# Altium schematic sheet Servo_PCB.SchDoc
size Letter; SheetNumber: 1; SheetTotal: 1
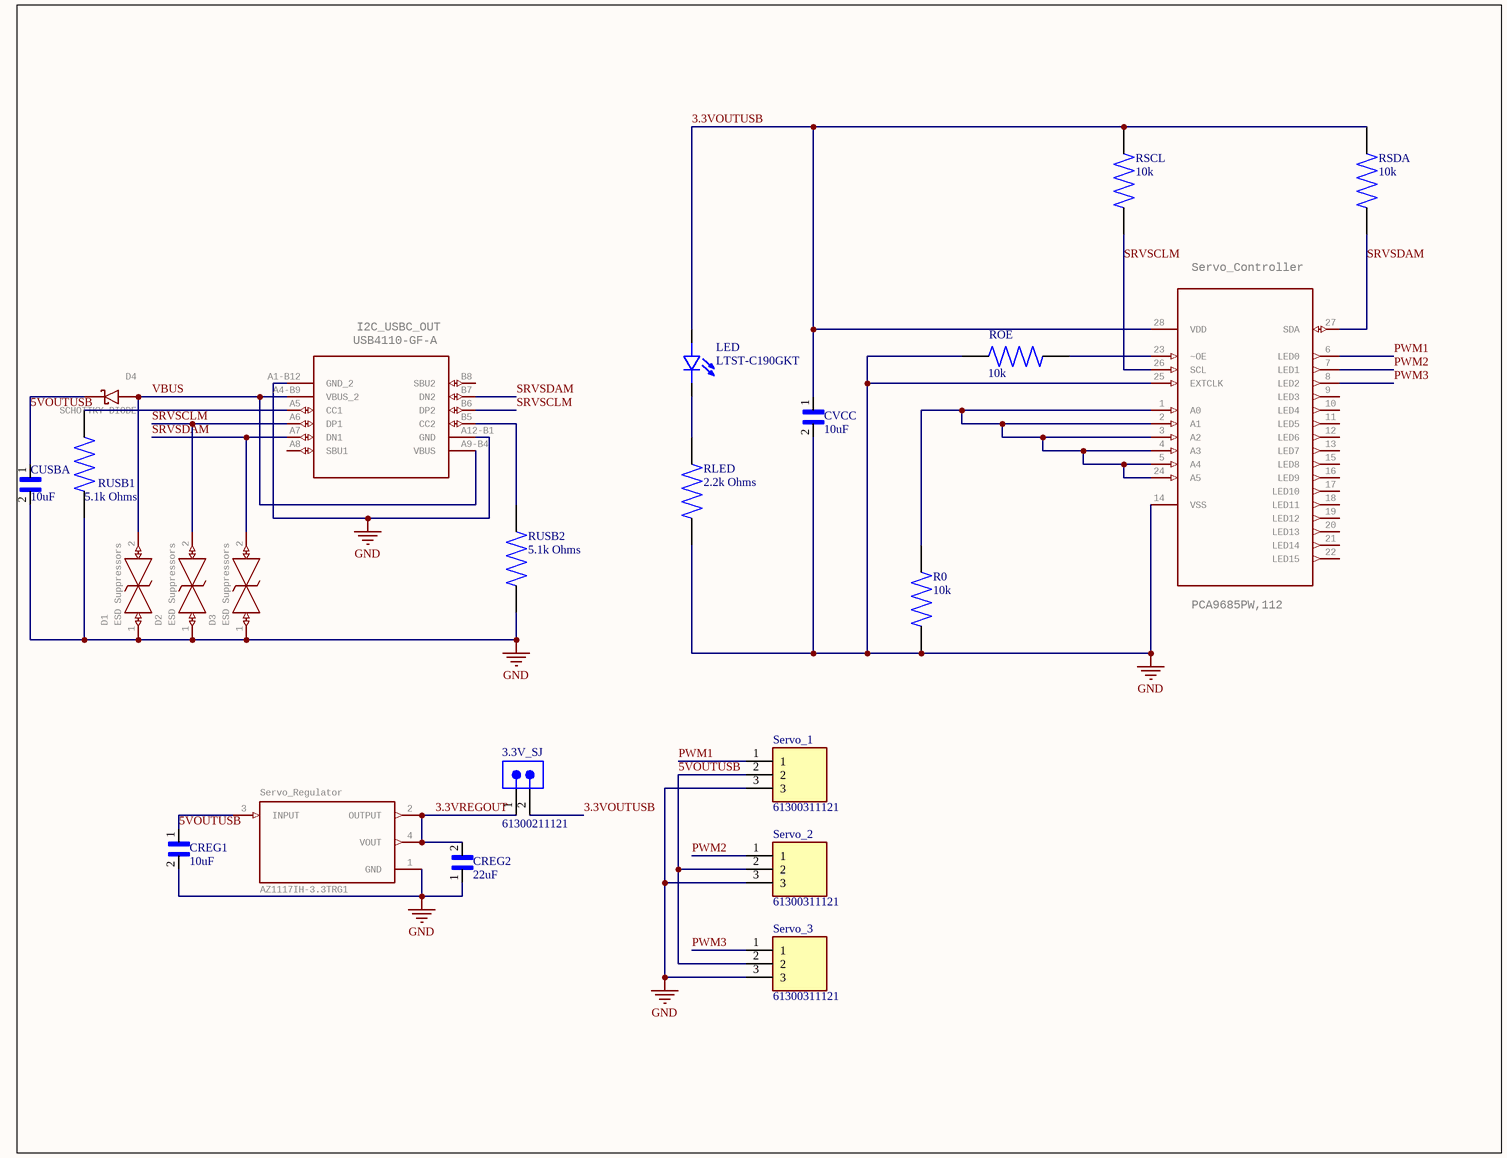
[diagram p0: Servo_PCB.SchDoc]

## Parts
3.3V_SJ  61300211121  [61300211121]
CREG1  10uF  [CAPC2012X88N]
CREG2  22uF  [CAPC2012X145N]
CUSBA  10uF  [CAPC2012X88N]
CVCC  10uF  [CAPC2012X88N]
D1  ESD Suppressors  [MBTB-D-SOD-923F-IMP-0402]
D2  ESD Suppressors  [MBTB-D-SOD-923F-IMP-0402]
D3  ESD Suppressors  [MBTB-D-SOD-923F-IMP-0402]
D4  SCHOTTKY DIODE  [SOD3715X145N]
I2C_USBC_OUT  USB4110-GF-A  [USB4110-GF-A_GCT]
LED  LTST-C190GKT  [LEDC1608X35N]
R0  10k  [RESC2012X55N]
RLED  2.2k Ohms  [RESC2012X60N]
ROE  10k  [RESC2012X55N]
RSCL  10k  [RESC2012X55N]
RSDA  10k  [RESC2012X55N]
RUSB1  5.1k Ohms  [RESC2012X60N]
RUSB2  5.1k Ohms  [RESC2012X60N]
Servo_1  61300311121  [HDRV3W64P0X254_1X3_762X254X869P]
Servo_2  61300311121  [HDRV3W64P0X254_1X3_762X254X869P]
Servo_3  61300311121  [HDRV3W64P0X254_1X3_762X254X869P]
Servo_Controller  PCA9685PW,112  [SOP65P640X110-28N]
Servo_Regulator  AZ1117IH-3.3TRG1  [SOT230P700X185-4N]

## Nets
GND: CREG1.2 CREG2.1 CUSBA.2 CVCC.2 D1.1(K) D2.1(K) D3.1(K) I2C_USBC_OUT.A1-B12(GND_2) I2C_USBC_OUT.A12-B1(GND) R0.1 RLED.2 ROE.2 RUSB1.1 RUSB2.1 Servo_1.3 Servo_2.3 Servo_3.3 Servo_Controller.14(VSS) Servo_Controller.25(EXTCLK) Servo_Regulator.1(GND)
3.3VOUTUSB: 3.3V_SJ.2 CVCC.1 LED.A RSCL.2 RSDA.2 Servo_Controller.28(VDD)
3.3VREGOUT: 3.3V_SJ.1 CREG2.2 Servo_Regulator.2(OUTPUT) Servo_Regulator.4(VOUT)
5VOUTUSB: CREG1.1 CUSBA.1 D4.C(K) Servo_1.2 Servo_2.2 Servo_3.2 Servo_Regulator.3(INPUT)
PWM1: Servo_1.1 Servo_Controller.6(LED0)
PWM2: Servo_2.1 Servo_Controller.7(LED1)
PWM3: Servo_3.1 Servo_Controller.8(LED2)
SRVSCLM: D2.2(A) I2C_USBC_OUT.A6(DP1) I2C_USBC_OUT.B6(DP2) RSCL.1 Servo_Controller.26(SCL)
SRVSDAM: D3.2(A) I2C_USBC_OUT.A7(DN1) I2C_USBC_OUT.B7(DN2) RSDA.1 Servo_Controller.27(SDA)
VBUS: D1.2(A) D4.A I2C_USBC_OUT.A4-B9(VBUS_2) I2C_USBC_OUT.A9-B4(VBUS)
NetI2C_USBC_OUT_A5: I2C_USBC_OUT.A5(CC1) RUSB1.2
NetI2C_USBC_OUT_B5: I2C_USBC_OUT.B5(CC2) RUSB2.2
NetLED_C: LED.C RLED.1
NetR0_2: R0.2 Servo_Controller.1(A0) Servo_Controller.2(A1) Servo_Controller.3(A2) Servo_Controller.4(A3) Servo_Controller.5(A4) Servo_Controller.24(A5)
NetROE_1: ROE.1 Servo_Controller.23(~OE)

Not connected (* = marked no-connect by the designer): I2C_USBC_OUT A8(SBU1) B8(SBU2); Servo_Controller 9(LED3) 10(LED4) 11(LED5) 12(LED6) 13(LED7) 15(LED8) 16(LED9) 17(LED10) 18(LED11) 19(LED12) 20(LED13) 21(LED14) 22(LED15)

## Library data of the parts
3.3V_SJ = CMP-1712-00002-5: CONN HEADER VERT 2POS 2.54MM; NexarPartId: 20081794; Operating Supply Voltage: 250V; Current Rating: 3A; Gender: Male; Number of Contacts: 2; Connector Type: Male Pin; Contact Resistance: 20mΩ; Contact Plating: Gold; Contact Material: Copper; Number of Pins: 2; Min Operating Temperature: -40°C; Packaging: Bulk; Lead Pitch: 2.54mm; Mount: Through Hole; Orientation: Vertical; RoHS: Compliant; Pitch: 2.54mm; REACH SVHC: No SVHC; Height: 8.94mm; Termination: Through Hole; Number of Positions: 2; Contact Mating Length: 5.9944mm; Color: Black; Contact Gender: Male; Number of Rows: 1; Housing Material: PBT; Lead Free: Lead Free; Voltage Rating: 250V; Max Operating Temperature: 125°C
CREG1 = C0805C106J8RACAUTO: 10ÂµF Â±5% 10V Ceramic Capacitor X7R 0805 _2012 Metric_; MF: KEMET; Price: None; SnapEDA_Link: https://www.snapeda.com/parts/C0805C106J8RACAUTO/KEMET/view-part/3596814/?ref=snap; MP: C0805C106J8RACAUTO; Availability: Unavailable; Value: *; Package: 0805 KEMET
CREG2 = GRM21BR61C226ME44L: SMD Capacitor X5R(EIA) with Capacitance: 22uF Tol. 20%. Rated Voltage: 16Vdc; MF: Murata; Arrow_Electronics-Purchase-URL: https://snapeda.com/shop?store=Arrow+Electronics&id=4387753; Value: *; Package: 2012 Murata; MP: GRM21BR61C226ME44L; DigiKey-Purchase-URL: https://snapeda.com/shop?store=DigiKey&id=4387753; Mouser-Purchase-URL: https://snapeda.com/shop?store=Mouser&id=4387753; SnapEDA_Link: https://www.snapeda.com/parts/GRM21BR61C226ME44L/Murata/view-part/4387753/?ref=snap; Digi-Key_Part_Number: 490-10747-1-ND
CUSBA CVCC = C0805C106J8RACAUTO: CAP CER 10UF 10V X7R 0805; MF: KEMET; Price: None; SnapEDA_Link: https://www.snapeda.com/parts/C0805C106J8RACAUTO/KEMET/view-part/3596814/?ref=snap; MP: C0805C106J8RACAUTO; Availability: Unavailable; Value: *; Package: 0805 KEMET
D1-D3 = CPDQ5V0-HF: TVS DIODE 5VWM 18.6V 0402/SOD923; GateName_1: G$1; MF: Comchip Technology; SymbolName_1: CPDQ5V0-HF; LibraryName: CPDQ5V0-HF; DeviceSetName: CPDQ5V0-HF; Package: MBTB-D-SOD-923F-IMP-0402; Package: 0402 Comchip; Price: None; Check_prices: https://www.snapeda.com/parts/CPDQ5V0-HF/Comchip+Technology/view-part/?ref=eda; SnapEDA_Link: https://www.snapeda.com/parts/CPDQ5V0-HF/Comchip+Technology/view-part/?ref=snap; MP: CPDQ5V0-HF; Availability: In Stock; Purchase-URL: https://www.snapeda.com/api/url_track_click_mouser/?unipart_id=809934&manufacturer=Comchip Technology&part_name=CPDQ5V0-HF&search_term=cpdq5v0-hf
D4 = 1N5819HW-7-F: DIODE SCHOTTKY 40V 1A SOD123; GateName_1: G$1; MF: Diodes Inc.; SymbolName_1: 1N5819HW-7-F; LibraryName: 1N5819HW-7-F; DeviceSetName: 1N5819HW-7-F; Package: SOD3715X145N; Package: SOD-123 Fairchild Semiconductor; Price: None; Check_prices: https://www.snapeda.com/parts/1N5819HW-7-F/Diodes+Inc./view-part/?ref=eda; SnapEDA_Link: https://www.snapeda.com/parts/1N5819HW-7-F/Diodes+Inc./view-part/?ref=snap; MP: 1N5819HW-7-F; Availability: In Stock; Purchase-URL: https://www.snapeda.com/api/url_track_click_mouser/?unipart_id=42272&manufacturer=Diodes Inc.&part_name=1N5819HW-7-F&search_term=1n5819hw-7-f
I2C_USBC_OUT = USB4110-GF-A: CONN RCP USB2.0 TYP C 24P SMD RA; MFR_NAME: Global Connector Technology; GateName_1: A; SymbolName_1: USB4110-GF-A; LibraryName: USB4110-GF-A; DeviceSetName: USB4110-GF-A; Package: USB4110-GF-A_GCT; COPYRIGHT: Copyright (C) 2023 Ultra Librarian. All rights reserved.; MANUFACTURER_PART_NUMBER: USB4110-GF-A
LED = LTST-C190GKT: Green 569nm LED Indication - Discrete 2.1V 0603 (1608 Metric); MF: Lite-On Inc.; SnapEDA_Link: https://www.snapeda.com/parts/LTST-C190GKT/Lite-On+Inc./view-part/?ref=snap; Package: 0603 Lite-On; Value: *; MP: LTST-C190GKT; Check_prices: https://www.snapeda.com/parts/LTST-C190GKT/Lite-On+Inc./view-part/?ref=eda
R0 ROE RSCL RSDA = TNPW080510K0FEEA: RES 10K OHM 1% 1/8W 0805; Package: None; Price: None; Value: *; MP: TNPW080510K0FEEA; Availability: Unavailable
RLED = AC0805FR-072K2L: Fixed Resistor, Metal Glaze/thick Film, 0.125W, 2200ohm, 150V, 1% +/-Tol, 100ppm/Cel, Surface Mount, 0805; Package: None; Price: None; Value: *; MP: AC0805FR-072K2L; Availability: Unavailable
RUSB1 RUSB2 = RC0805JR-075K1L: RC0805 5,1K 5% 0,125W; Package: None; Price: None; Value: *; MP: RC0805JR-075K1L; Availability: Unavailable
Servo_1 = 61300311121: CONN HEADER VERT 3POS 2.54MM; Manufacturer_Name: Wurth Elektronik; Datasheet Link: http://katalog.we-online.de/em/datasheet/6130xx11121.pdf; Height: 8.69mm; Manufacturer_Part_Number: 61300311121; Mouser Part Number: 710-61300311121; Mouser Price/Stock: https://www.mouser.co.uk/ProductDetail/Wurth-Elektronik/61300311121?qs=PhR8RmCirEYxRWFJzNKsUw%3D%3D
Servo_2 Servo_3 = 61300311121: Connector; Manufacturer_Name: Wurth Elektronik; Datasheet Link: http://katalog.we-online.de/em/datasheet/6130xx11121.pdf; Height: 8.69mm; Manufacturer_Part_Number: 61300311121; Mouser Part Number: 710-61300311121; Mouser Price/Stock: https://www.mouser.co.uk/ProductDetail/Wurth-Elektronik/61300311121?qs=PhR8RmCirEYxRWFJzNKsUw%3D%3D
Servo_Controller = PCA9685PW,112: IC LED DRVR LIN PWM 25MA 28TSSOP; GateName_1: A; MF: NXP USA; SymbolName_1: PCA9685PW,112; LibraryName: PCA9685PW_112; DeviceSetName: PCA9685PW,112; Package: SOP65P640X110-28N; Package: TSSOP-28 NXP Semiconductors; Price: None; Check_prices: https://www.snapeda.com/parts/PCA9685PW,112/NXP+USA+Inc./view-part/?ref=eda; SnapEDA_Link: https://www.snapeda.com/parts/PCA9685PW,112/NXP+USA+Inc./view-part/?ref=snap; MP: PCA9685PW,112; Availability: In Stock; Purchase-URL: https://pricing.snapeda.com/search?q=PCA9685PW,112&ref=eda
Servo_Regulator = AZ1117IH-3.3TRG1: IC REG LINEAR 3.3V 1A SOT223; GateName_1: G$1; MF: Diodes Inc.; SymbolName_1: AZ1117IH-3.3TRG1; LibraryName: AZ1117IH-3.3TRG1; DeviceSetName: AZ1117IH-3.3TRG1; Package: SOT230P700X185-4N; Package: SOT-223 Diodes Inc.; Price: None; Check_prices: https://www.snapeda.com/parts/AZ1117IH-3.3TRG1/Diodes+Inc./view-part/?ref=eda; SnapEDA_Link: https://www.snapeda.com/parts/AZ1117IH-3.3TRG1/Diodes+Inc./view-part/?ref=snap; MP: AZ1117IH-3.3TRG1; Availability: In Stock; Purchase-URL: https://www.snapeda.com/api/url_track_click_mouser/?unipart_id=490259&manufacturer=Diodes Inc.&part_name=AZ1117IH-3.3TRG1&search_term=az1117ih-3.3trg1